# EasyEDA Pro project 3轴6.1--esp32 -(0105).eprj, board PCB
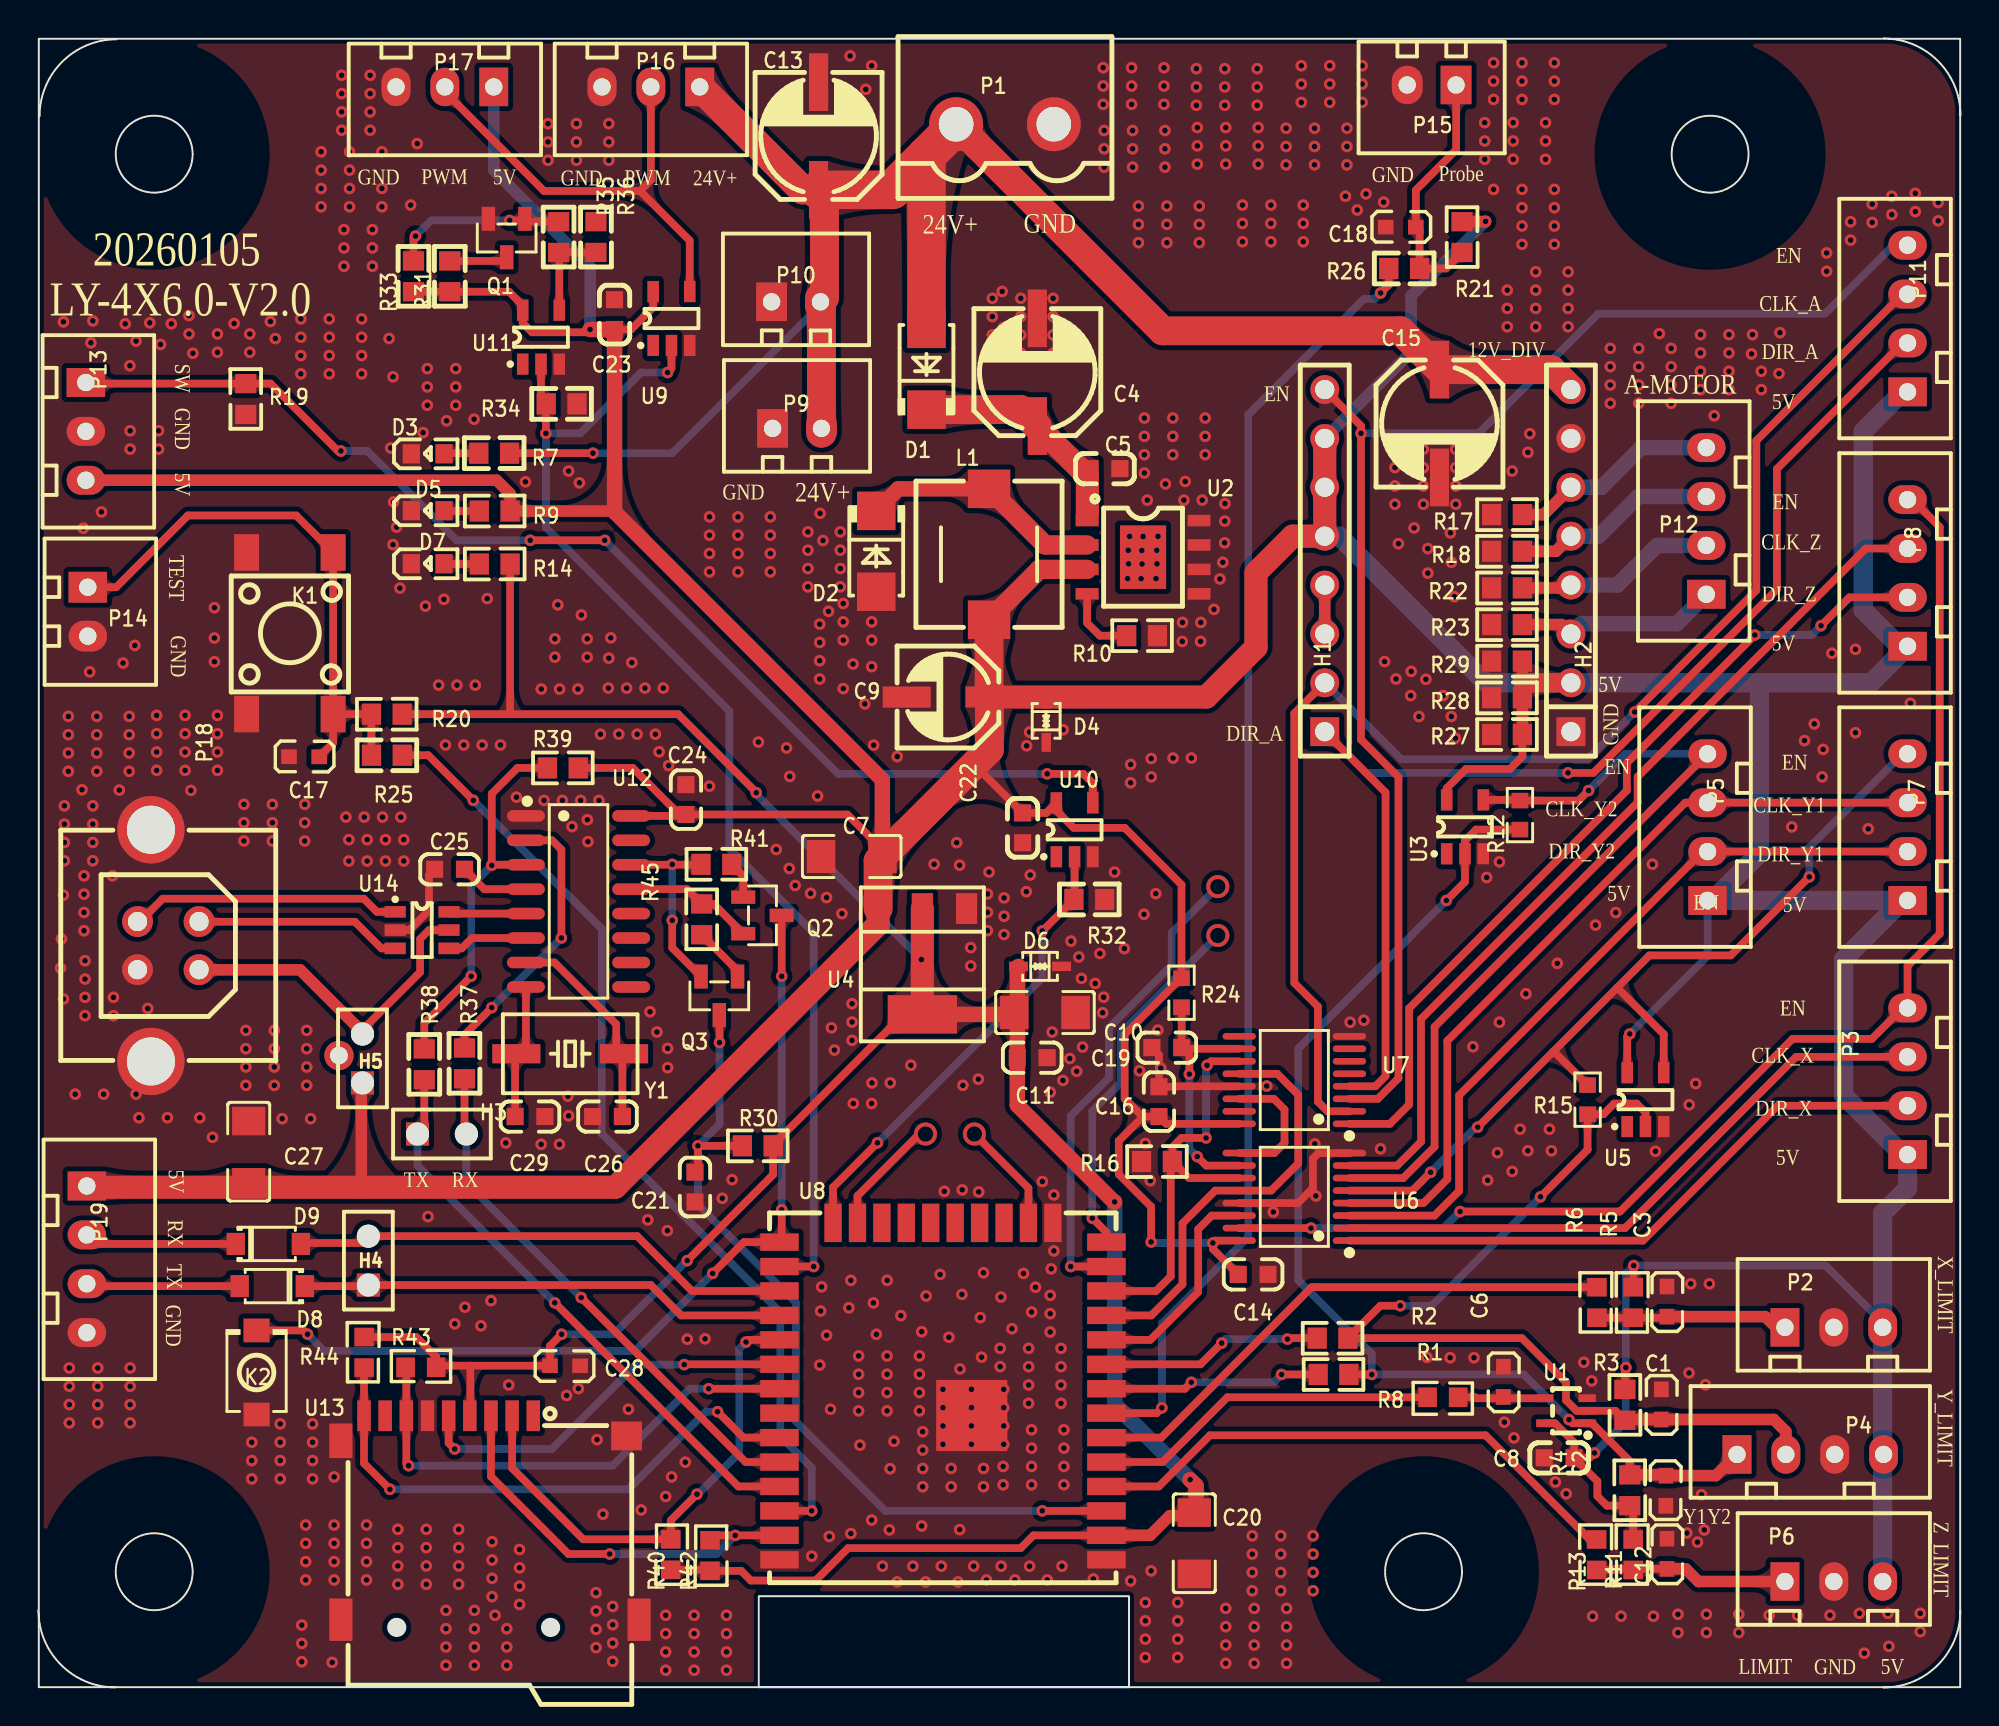
[diagram p1: board, top side]
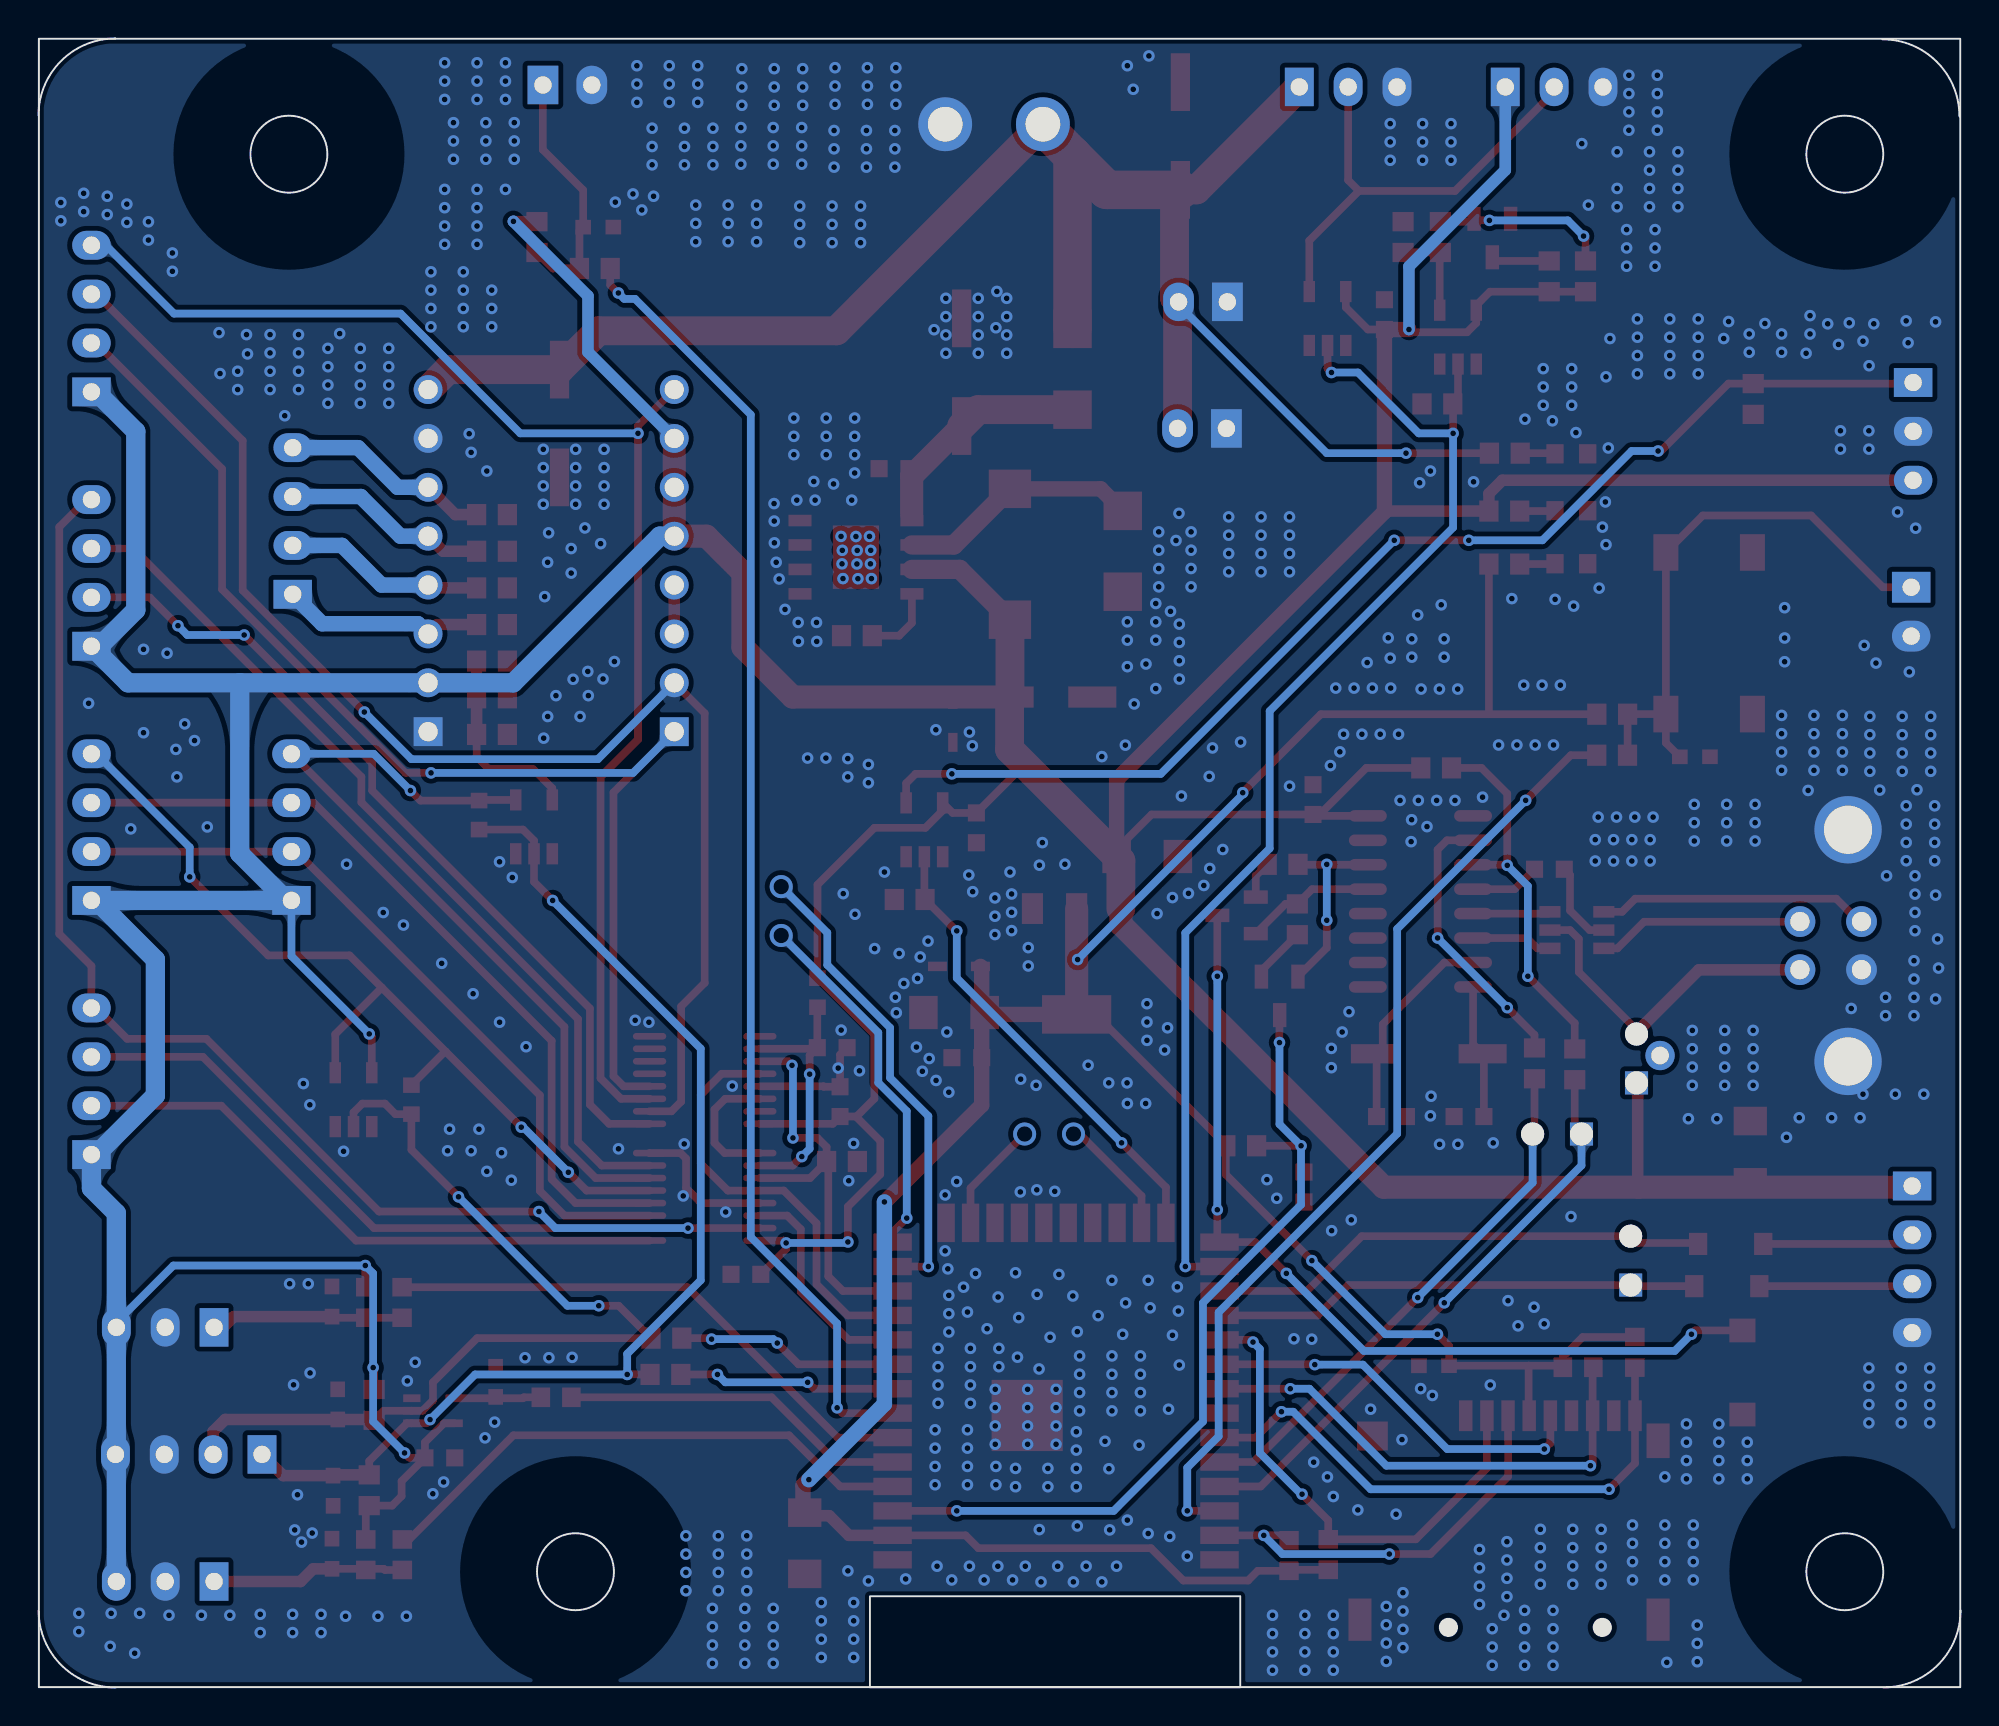
[diagram p2: board, bottom side, seen from below]

Outline 99.94 x 85.7 mm; copper layers: Top Layer, Bottom Layer. Coordinates in mm from the lower left corner of the outline.
Outline path: rectangle 0.02,85.69 99.92,0.02 ; circle c6.02,79.69 r2 ; circle c6.02,6.02 r2 ; rectangle 37.45,4.74 56.7,0.02 ; circle c72.02,6.02 r2 ; circle c86.92,79.69 r2 ; 0.06,81.66 arc(1.23,84.49) 4.06,85.66 ; 4,0.01 arc(1.17,1.18) 0,4.01 ; 95.94,85.7 arc(98.77,84.53) 99.94,81.7 ; 99.93,4 arc(98.76,1.17) 95.93,0
Stack: Top Layer 0.035mm / Dielectric1 1.51mm FR4 er 4.5 / Bottom Layer 0.035mm

## Design rules (mm)
template: 用户自定义配置
spacing Default (default): track to track 0.152, other pairs 0 to 0.152
track width Default (default): min 0.254, default 0.254, max 25.4
differential pair differentialPair (default): width min 0.127, default 0.254, max 2.54; gap min 0.152, default 0.152
via Default (default): diameter min 0.25, default 0.61, max 100.025; hole min 0.2, default 0.305, max 59.995

## Placement (name value [footprint] x y rotation side)
C1  103  [11]  84.68 15.45 90 top
C2  103  [11]  84.32 9.49 270 top
C3  103  [11]  84.97 20.8 90 top
C4  100uF/35V  [电解电容贴片6X6]  51.94 68.36 90 top
C5  104  [0603C]  55.45 63.34 180 top
C6  103  [11]  76.47 16.63 90 top
C7  10uF  [C1206]  42.29 43.19 180 top
C8  104  [0603C]  79.07 11.94 0 top
C9  100uF/10V  [CAP-SMD_BD5.0-L5.3-W5.3-RD]  47.3 51.48 0 top
C10  4.7uF  [C1206]  52.33 35.08 180 top
C11  104  [0603C]  51.67 32.73 180 top
C12  103  [11]  84.97 7.69 90 top
C13  100uF/35V  [电解电容贴片6X6]  40.56 80.63 90 top
C14  104  [0603C]  63.16 21.47 0 top
C15  100uF/35V(47uF/50V)  [电解电容贴片6X6]  72.85 65.69 270 top
C16  104  [0603C]  58.26 30.45 90 top
C17  103  [11]  13.07 48.67 180 top
C18  103  [11]  70.09 76.2 180 top
C19  104  [0603C]  58.67 33.25 0 top
C20  4.7uF  [C1206]  60.1 7.5 270 top
C21  104  [0603C]  34.14 26.01 90 top
C22  104  [0603C]  51.17 44.68 90 top
C23  104  [0603C]  29.95 71.35 270 top
C24  104  [0603C]  33.67 46.15 90 top
C25  104  [0603C]  21.38 42.53 180 top
C26  18pF  [0603C]  29.59 29.67 180 top
C27  10uF  [C1206]  10.93 27.85 90 top
C28  104  [11]  28.12 16.42 0 top
C29  18pF  [0603C]  25.56 29.67 0 top
D1  SS56  [SMA]  46.17 68.51 90 top
D2  SS34  [SMA]  43.56 59.05 270 top
D3  绿光  [0603LED]  20.2 64.1 180 top
D4  PESD5V0L1BA-N  [SOD-323_L1.8-W1.3-LS2.5-BI]  52.39 50.24 90 top
D5  绿光  [0603LED]  20.2 61.14 180 top
D6  PESD3V3L1BA-N  [SOD-323_L1.8-W1.3-LS2.5-BI]  52.08 37.48 180 top
D7  绿光  [0603LED]  20.2 58.39 180 top
D8  1N4148  [SOD-123_L2.8-W1.8-LS3.7-RD]  12.16 20.86 180 top
D9  1N4148  [SOD-123_L2.8-W1.8-LS3.7-RD]  11.95 23.05 0 top
H1  PZ254V-11-08P  [HDR-TH_8P-P2.54-V-M]  66.88 58.57 90 top
H2  PZ254V-11-08P  [HDR-TH_8P-P2.54-V-M]  79.68 58.57 90 top
H3  PZ254V-11-02P  [HDR-TH_2P-P2.54-V-M]  20.98 28.77 0 top
H4  PZ254V-11-02P  [HDR-TH_2P-P2.54-V-M]  17.15 22.19 90 top
H5  PZ254V-11-02P  [HDR-TH_2P-P2.54-V-M]  16.85 32.69 90 top
K1  SW_6X6_H=12.0MM  [KEY-SMD_4P-L6.0-W6.0-P4.50-LS9.0]  13.07 54.79 90 top
K2  TS-1088-AR02016  [SW-SMD_L3.9-W3.0-P4.45]  11.34 16.37 90 top
L1  68uH  [IND-SMD_L7.0-W7.0_SMDRI74-330MT]  49.43 58.9 90 top
NOREF  -  [Pad_e6922]  15.62 32.85 0 top
P1  KF2EDGVC-5.08-2P  [CONN-TH_P5.08_KF2EDGVC-5.08-2P]  50.25 81.24 180 top
P2  3P  [HDR1X3_CON]  93.35 18.72 0 top
P3  4P  [HDR1X4_CON]  97.18 27.7 90 top
P4  4P  [HDR1X4_CON]  88.32 12.11 0 top
P5  4P  [HDR1X4_CON]  86.78 40.91 90 top
P6  3P  [HDR1X3_CON]  93.35 5.51 0 top
P7  4P  [HDR1X4_CON]  97.18 40.91 90 top
P8  4P  [HDR1X4_CON]  97.18 54.11 90 top
P9  2P  [HDR1X2_CON]  39.44 65.44 0 top
P10  2P  [HDR1X2_CON]  39.39 72.01 0 top
P11  4P  [HDR1X4_CON]  97.18 67.34 90 top
P12  4P  [HDR1X4_CON]  86.72 56.82 90 top
P13  3P  [HDR1X3_CON]  2.47 65.28 270 top
P14  2P  [HDR1X2_CON]  2.57 55.91 270 top
P15  2P  [HDR1X2_CON]  72.44 83.28 180 top
P16  3P  [HDR1X3_CON]  31.84 83.18 180 top
P17  3P  [HDR1X3_CON]  21.13 83.18 180 top
P18  USB-B12-BRW  [USB-B-TH_USB-B12-BRW]  6.75 38.56 270 top
P19  4P  [HDR1X4_CON]  2.52 26.06 270 top
Q1  SS8050  [SOT-23-3_L2.9-W1.3-P1.90-LS2.4-BR]  24.34 75.33 90 top
Q2  SS8050  [SOT-23-3_L2.9-W1.3-P1.90-LS2.4-BR]  37.64 40.13 180 top
Q3  SS8050  [SOT-23-3_L2.9-W1.3-P1.90-LS2.4-BR]  35.4 35.95 90 top
R1  10K  [0603R]  67.34 16.27 180 top
R2  10K  [0603R]  67.29 18.16 180 top
R3  10K  [0603R]  82.49 14.69 270 top
R4  10K  [0603R]  82.74 10.25 90 top
R5  47K  [10]  83.04 19.12 90 top
R6  100Ω  [10]  81.15 19.12 90 top
R7  47K  [0603R]  23.69 64.15 0 top
R8  47K  [10]  73.92 15.2 180 top
R9  10K  [0603R]  23.72 61.14 0 top
R10  10K  [0603R]  57.38 54.66 0 top
R11  47K  [10]  83.04 6.01 90 top
R12  0Ω  [R0603]  77.03 45.34 270 top
R13  100Ω  [10]  81.14 6.01 90 top
R14  10K  [0603R]  23.72 58.39 0 top
R15  0Ω  [R0603]  80.55 30.55 270 top
R16  10K  [0603R]  58.16 27.34 180 top
R17  10K  [0603R]  76.36 60.96 180 top
R18  10K  [0603R]  76.36 59.05 180 top
R19  10K  [0603R]  10.78 66.97 90 top
R20  10K  [0603R]  18.11 50.58 180 top
R21  10K  [0603R]  74.02 75.38 270 top
R22  10K  [0603R]  76.36 57.15 180 top
R23  10K  [0603R]  76.36 55.24 180 top
R24  10kΩ  [R0603]  59.43 36.11 90 top
R25  100  [0603R]  18.12 48.45 180 top
R26  100  [0603R]  71.01 73.75 0 top
R27  10K  [0603R]  76.36 49.53 180 top
R28  10K  [0603R]  76.36 51.44 180 top
R29  10K  [0603R]  76.36 53.34 180 top
R30  10K  [0603R]  37.4 28.15 180 top
R31  10K  [0603R]  21.39 73.34 270 top
R32  10K  [0603R]  54.64 40.95 0 top
R33  10K  [0603R]  19.5 73.34 270 top
R34  10K  [0603R]  27.2 66.71 0 top
R35  1K  [0603R]  27.05 75.38 90 top
R36  0Ω  [0603R]  28.99 75.38 270 top
R37  470Ω  [0603R]  22.15 32.44 90 top
R38  470Ω  [0603R]  20.06 32.39 90 top
R39  10K  [0603R]  27.27 47.79 0 top
R40  10K  [10]  32.76 7.8 270 top
R41  10K  [0603R]  35.25 42.78 0 top
R42  10K  [10]  34.8 7.75 270 top
R43  10K  [10]  18.99 16.53 0 top
R44  10K  [10]  17.05 16.53 90 top
R45  10K  [0603R]  34.48 39.92 270 top
U1  SN74AHC1G08  [SC-70-5_L2.1-W1.3-P0.65-LS2.1-BR]  79.42 14.38 0 top
U2  XL1509-5.0E1//SXL1509-5.0E1  [ESOP-8_L4.9-W3.9-P1.27-LS6.0-BL-EP]  57.43 58.74 270 top
U3  74LVC1G17  [SOT-23-5]  74.17 44.73 90 top
U4  1117-3.3  [SOT-223]  45.96 37.78 180 top
U5  74LVC1G17  [SOT-23-5]  83.56 30.55 90 top
U6  74AHCT595T16-13  [TSSOP-16_L5.0-W4.4-P0.65-LS6.4-BL]  65.3 25.5 90 top
U7  74AHCT595T16-13  [TSSOP-16_L5.0-W4.4-P0.65-LS6.4-BL]  65.3 31.57 90 top
U8  ESP32-WROOM-32  [WIFI-SMD_ESP32-WROOM-32UE-A]  47.03 15.39 180 top
U9  74LVC1G17  [SOT-23-5]  32.91 71.15 90 top
U10  74LVC1G17  [SOT-23-5]  53.87 44.58 90 top
U11  74LVC1G17  [SOT-23-5]  26.13 70.18 90 top
U12  CH340G  [SOIC-16_L9.9-W3.9-P1.27-LS6.0-BL]  28.08 40.85 270 top
U13  自弹TF卡座TFAA  [SIM-SMD_C9900015645]  23.48 8.82 0 top
U14  USBLC2-2SC6  [SOT-23-6]  19.95 39.36 0 top
Y1  12M  [晶振贴片49SSMD]  27.65 32.94 0 top

## Footprints (pads in the part's own frame, mm; a bottom-side part is the same pattern mirrored in y, then rotated)
10
  rect 0.965x1.016 smd: 1(0.101,0.117) 2(1.688,0.117)
11
  rect 0.813x0.762 smd: 1(0.043,0.296) 2(-1.524,0.301)
0603C
  rect 0.889x0.889 smd: 1(-0.774,0) 2(0.774,0)
0603LED
  rect 0.9x1 smd: 1(-0.884,-0.017) 2(0.816,-0.017)
0603R
  rect 1x1.1 smd: 1(-0.8,0) 2(0.8,0)
C1206
  rect 1.485x1.728 smd: 1(-1.593,0) 2(1.593,0)
CAP-SMD_BD5.0-L5.3-W5.3-RD
  rect 2.5x1.1 smd: 1(2.15,0) 2(-2.15,0)
CONN-TH_P5.08_KF2EDGVC-5.08-2P
  round 2.8 hole 1.8: 1(-2.54,0) 2(2.54,0)
ESOP-8_L4.9-W3.9-P1.27-LS6.0-BL-EP
  rect 0.6x1.2 smd: 1(-1.905,-2.909) 2(-0.635,-2.909) 3(0.635,-2.909) 4(1.905,-2.909) 5(1.905,2.909) 6(0.635,2.909) 7(-0.635,2.909) 8(-1.905,2.909)
  rect 3.3x2.4 smd: 9(0,0)
HDR1X2_CON
  rect 1.6x2 hole 0.9: 1(-1.27,0)
  oval 1.6x2 hole 0.9: 2(1.27,0)
HDR1X3_CON
  rect 1.5x2 hole 0.9: 1(-2.54,0)
  oval 1.5x2 hole 0.9: 2(0,0) 3(2.54,0)
HDR1X4_CON
  rect 1.5x2 hole 0.9: 1(0,0)
  oval 1.5x2 hole 0.9: 2(2.54,0) 3(5.08,0) 4(7.62,0)
HDR-TH_2P-P2.54-V-M
  rect 1.2x1.2 hole 1.2x0.8: 1(-1.27,0)
  round 1.2 hole 1.2x0.8: 2(1.27,0)
HDR-TH_8P-P2.54-V-M
  rect 1.5x1.5 hole 1: 1(-8.89,0)
  round 1.5 hole 1: 2(-6.35,0) 3(-3.81,0) 4(-1.27,0) 5(1.27,0) 6(3.81,0) 7(6.35,0) 8(8.89,0)
IND-SMD_L7.0-W7.0_SMDRI74-330MT
  rect 2x2.2 smd: 1(-3.4,0) 2(3.4,0)
KEY-SMD_4P-L6.0-W6.0-P4.50-LS9.0
  rect 1.9x1.3 smd: 1(-4.2,2.25) 2(4.2,2.25) 3(-4.2,-2.25) 4(4.2,-2.25)
Pad_e6922
  round 1.524 hole 0.914: 1(0,0)
R0603
  rect 0.806x0.864 smd: 1(-0.753,0) 2(0.753,0)
SC-70-5_L2.1-W1.3-P0.65-LS2.1-BR
  rect 0.9x0.4 smd: 1(1.1,-0.65) 2(1.1,0) 3(1.1,0.65) 4(-1.1,0.65) 5(-1.1,-0.65)
SIM-SMD_C9900015645
  rect 0.7x1.6 smd: 1(2.25,5.3) 2(1.15,5.3) 3(0.05,5.3) 4(-1.05,5.3) 5(-2.15,5.3) 6(-3.25,5.3) 7(-4.35,5.3) 8(-5.45,5.3) 9(-6.55,5.3)
  rect 1.2x1.8 smd: 10(-7.75,4)
  rect 1.6x1.5 smd: 11(7.1,4.25)
  rect 1.2x2.2 smd: 12(-7.75,-5.3) 13(7.75,-5.3)
SMA
  rect 2x2 smd: 1(2.1,0) 2(-2.1,0)
SOD-123_L2.8-W1.8-LS3.7-RD
  rect 0.95x1.15 smd: 1(-1.692,0) 2(1.692,0)
SOD-323_L1.8-W1.3-LS2.5-BI
  rect 0.986x0.49 smd: 1(-1.117,0) 2(1.117,0)
SOIC-16_L9.9-W3.9-P1.27-LS6.0-BL
  oval 0.602x1.971 smd: 1(-4.445,-2.736) 2(-3.175,-2.736) 3(-1.905,-2.736) 4(-0.635,-2.736) 5(0.635,-2.736) 6(1.905,-2.736) 7(3.175,-2.736) 8(4.445,-2.736) 9(4.445,2.736) 10(3.175,2.736) 11(1.905,2.736) 12(0.635,2.736) 13(-0.635,2.736) 14(-1.905,2.736) 15(-3.175,2.736) 16(-4.445,2.736)
SOT-23-3_L2.9-W1.3-P1.90-LS2.4-BR
  rect 1.25x0.7 smd: 1(1,-0.95) 2(1,0.95) 3(-1,0)
SOT-23-5
  rect 1.1x0.6 smd: 1(-1.4,0.95) 2(-1.4,0) 3(-1.4,-0.95) 4(1.4,-0.95) 5(1.4,0.95)
SOT-23-6
  rect 1.1x0.6 smd: 1(-1.4,0.95) 2(-1.4,0) 3(-1.4,-0.95) 4(1.4,-0.95) 5(1.4,0) 6(1.4,0.95)
SOT-223
  rect 1.1x1.6 smd: 1(-2.3,-2.7) 2(0,-2.7) 3(2.3,-2.7)
  rect 3.6x2 smd: 4(0,2.8)
SW-SMD_L3.9-W3.0-P4.45
  rect 1.23x1.36 smd: 1(-2.185,0) 2(2.185,0)
TSSOP-16_L5.0-W4.4-P0.65-LS6.4-BL
  oval 0.343x1.732 smd: 1(-2.275,-2.866) 2(-1.625,-2.866) 3(-0.975,-2.866) 4(-0.325,-2.866) 5(0.325,-2.866) 6(0.975,-2.866) 7(1.625,-2.866) 8(2.275,-2.866) 9(2.275,2.866) 10(1.625,2.866) 11(0.975,2.866) 12(0.325,2.866) 13(-0.325,2.866) 14(-0.975,2.866) 15(-1.625,2.866) 16(-2.275,2.866)
USB-B-TH_USB-B12-BRW
  round 1.6 hole 1: 1(1.25,1.6) 2(-1.25,1.6) 3(-1.25,-1.6) 4(1.25,-1.6)
  round 3.5 hole 2.5: 5(-6.02,-0.9) 6(6.02,-0.9)
WIFI-SMD_ESP32-WROOM-32UE-A
  rect 2x0.9 smd: 1(-8.5,8.755) 2(-8.5,7.485) 3(-8.5,6.215) 4(-8.5,4.945) 5(-8.5,3.675) 6(-8.5,2.405) 7(-8.5,1.135) 8(-8.5,-0.135) 9(-8.5,-1.405) 10(-8.5,-2.675) 11(-8.5,-3.945) 12(-8.5,-5.215) 13(-8.5,-6.485) 14(-8.5,-7.755) 25(8.5,-7.755) 26(8.5,-6.485) 27(8.5,-5.215) 28(8.5,-3.945) 29(8.5,-2.675) 30(8.5,-1.405) 31(8.5,-0.135) 32(8.5,1.135) 33(8.5,2.405) 34(8.5,3.675) 35(8.5,4.945) 36(8.5,6.215) 37(8.5,7.485) 38(8.5,8.755)
  rect 0.9x2 smd: 15(-5.715,-8.755) 16(-4.445,-8.755) 17(-3.175,-8.755) 18(-1.905,-8.755) 19(-0.635,-8.755) 20(0.635,-8.755) 21(1.905,-8.755) 22(3.175,-8.755) 23(4.445,-8.755) 24(5.715,-8.755)
  rect 3.7x3.7 smd: 39(-1.5,1.255)
晶振贴片49SSMD
  rect 2.5x1 smd: 1(-2.8,0) 2(2.8,0)
电解电容贴片6X6
  rect 3x1 smd: 1(-2.8,0) 2(2.8,0)

## Nets
As in the schematic.

Pads without a net: NOREF 1; U2 9; U3 1; U5 1; U7 9; U8 17 18 19 20 21 22 32; U9 1; U10 1; U11 1; U12 9 10 11 12 15; U13 1 8

## Via types
v1: diameter 0.6, hole 0.3, Top Layer to Bottom Layer, 996 vias
v2: diameter 1.2, hole 0.8, Top Layer to Bottom Layer, 4 vias

## Routing (per net, layer and track width the routed paths; a pad name or vN(x,y) marks a point on that pad's centre or on a via; arc(x,y) is an arc through that point)
3V3: length 153.6
  Top Layer w0.4: v1(27.2,18.36) 26.59,17.75 C28.2 22.46,16.72 ; U8.2 51.73,7.91 51.07,7.24 42.09,7.24 40.41,5.56 37.04,5.56 36.54,6.06 R42.2 34.86,6.12 R40.2 ; 24.53,50.58 24.52,50.59 R14.2 ; 24.53,50.58 R20.1 ; 24.53,50.58 33.26,50.58 37.32,46.52 v1(37.32,46.5) ; v1(33.73,22.19) 38.2,26.66 38.2,28.2 44.98,34.98 U4.4 ; U13.4 22.46,14.15 22.46,16.72 ; 22.46,16.72 20.76,16.72 R43.2 20.68,17.18 19.65,18.21 R44.2
  Top Layer w0.6: 60.19,8.93 58.82,8.93 57.8,7.91 U8.2
  Top Layer w0.8: v1(59.88,10.8) 60.19,10.5 60.19,8.93 ; U4.4 50.64,34.98 ; D6.2 50.89,37.41 C11.2 50.89,30.27 55.92,25.24 v1(55.95,25.24)
  Top Layer w1.2: U4.2 U4.4 ; 50.64,34.98 C10.2
  Bottom Layer w0.4: v1(27.2,18.36) 29.9,18.36 v1(33.73,22.19) ; v1(45.91,37.83) 37.32,46.42 v1(37.32,46.5)
  Bottom Layer w0.8: v1(59.88,10.8) 55.95,14.73 v1(55.95,25.24)
5V_VCC: length 451.1
  Top Layer w0.4: v1(57.85,23.16) 57.85,24.99 56.17,26.67 56.17,28.41 57.43,29.67 ; R33.2 R31.2 24.47,72.54 25.18,71.83 U11.5 25.18,70.91 25.66,70.43 28.54,70.43 v1(28.68,70.58) ; C24.1 42.06,45.37 43.88,43.56 ; R27.1 77.16,48.38 76.52,47.74 74.22,47.74 73.22,46.74 73.22,46.13 ; R5.2 82.94,20.83 v1(82.94,21.93) ; 62.43,29.3 58.64,29.3 58.26,29.67 57.43,29.67 ; U9.5 31.96,71.73 30.81,70.58 C23.2 ; 48.77,47.79 48.83,47.79 C22.2 52.4,45.45 U10.5 52.92,45.58 53.82,44.68 56.48,44.68 59.43,41.72 R24.2 59.4,36.86 56.48,33.93 56.48,30.6 57.4,29.67 57.43,29.67 ; U12.16 33.39,45.3 30.9,47.79 R39.2 ; R11.2 82.92,9.27 R4.1 81.55,9.45 81.06,9.95 81.06,10.72 C8.2 ; v1(82.54,16.63) 82.49,16.58 R3.1 ; C8.2 80.65,11.94 v1(80.9,12.19) ; C8.2 79.84,12.74 78.85,13.73 U1.5 ; v1(82.74,33.97) 82.61,33.83 U5.5 ; 62.43,23.23 61.19,23.23 v1(61.07,23.1) 61.07,22.79 C14.1
  Top Layer w0.6: R21.1 75.23,76.18 v1(75.24,76.2) ; R29.1 R28.1 R27.1 ; 29.91,61.14 R9.2 24.52,62.05 23.82,62.74 P13.3 ; 16.74,26 16.79,26.04 16.79,31.31 16.85,31.37
  Top Layer w0.8: 43.88,43.56 43.88,47.18 29.95,61.1 C23.2 v1(28.68,70.58)
  Top Layer w1: H2.2 77.22,52.22 77.16,52.28 ; L1.1 52.04,58.11 U2.3
  Top Layer w1.2: H1.7 H1.6 H1.5 65.21,59.84 63.31,57.94 63.31,54.06 60.72,51.48 C9.1 ; 2.61,26 30,26 43.66,39.66 U4.3
  Top Layer w1.5: U4.3 43.66,42.97 C7.1 49.45,48.75 C9.1 49.43,51.5 L1.1
  Bottom Layer w0.4: v1(61.07,23.1) 57.9,23.1 v1(57.85,23.16) ; 95.89,18.97 92.93,21.93 v1(82.94,21.93) 82.54,21.52 v1(82.54,16.63) 82.54,13.82 v1(80.9,12.19) ; P5.1 86.78,38.01 v1(82.74,33.97)
  Bottom Layer w0.6: P17.1 23.67,78.86 28.68,73.85 v1(28.68,70.58) ; H1.7 71.37,69.4 71.37,72.32 v1(75.24,76.2)
  Bottom Layer w1: P6.3 P2.3 95.89,24.65 97.18,25.95 P3.1 96.93,27.7 93.86,30.77 93.86,37.83 96.93,40.91 ; H1.5 67.63,59.84 75.25,52.22 H2.2 89.47,52.22 ; 89.47,52.22 95.28,52.22 P8.1 96.76,54.11 94.88,56 94.88,65.28 96.93,67.34 P11.1 ; 89.47,52.22 89.47,43.34 87.03,40.91 ; 96.93,40.91 P7.1 ; 96.93,40.91 87.03,40.91 ; 87.03,40.91 P5.1
24V: length 95.7
  Top Layer w0.4: R7.2 v1(28.83,64.15)
  Top Layer w1.5: H2.8 78.65,68.49 C15.1 70.83,70.51 58.45,70.51 P1.2 ; C13.1 39.73,77.83 P16.1 ; P9.2 40.71,71.96 P10.2 40.87,72.22 40.87,77.83
  Top Layer w2: P1.2 47.71,81.15 46.17,79.61 ; D1.1 46.17,79.61 ; 46.17,79.61 44.39,77.83 C13.1
  Bottom Layer w0.4: P10.2 40.66,71.86 32.95,64.15 v1(28.83,64.15)
GND: length 18.5
  Top Layer w0.4: C19.1 58.26,32.89 C16.2 59.1,31.22 59.13,31.25 62.43,31.25 ; 62.43,25.18 65.48,25.18 66.27,25.96 66.27,27.49 66.55,27.77 68.16,27.77 U6.8 ; U14.2 19.28,39.36 20.3,40.38 20.3,42.23 C25.2
  vias: v1(1.19,38.9) v1(1.14,37.39) v1(1.3,70.97) v1(1.3,41.18) v1(1.3,35.78) v1(1.35,45.82) v1(1.35,44.87) v1(1.35,43.92) v1(1.35,42.97) v1(1.55,50.47) v1(1.55,49.52) v1(1.55,48.57) v1(1.55,47.61) v1(1.6,16.61) v1(1.6,15.65) v1(1.6,14.7) v1(1.6,13.75) v1(1.91,30.84) v1(2.26,46.66) v1(2.33,60.25) v1(2.37,42.19) v1(2.37,41.23) v1(2.37,40.28) v1(2.37,39.33) v1(2.42,37.77) v1(2.42,36.82) v1(2.42,35.87) v1(2.42,34.92) v1(2.66,52.78) v1(2.73,69.89) v1(2.83,71.02) v1(2.83,45.82) v1(2.83,44.87) v1(2.83,43.92) v1(2.83,42.97) v1(3.03,50.47) v1(3.03,49.52) v1(3.03,48.57) v1(3.03,47.61) v1(3.08,16.61) v1(3.08,15.65) v1(3.08,14.7) v1(3.08,13.75) v1(3.28,61.09) v1(3.39,30.84) v1(3.85,42.19) v1(3.9,35.87) v1(3.9,34.92) v1(4.2,46.64) v1(4.4,53.24) v1(4.51,70.87) v1(4.75,68.69) v1(4.77,65.31) v1(4.77,64.36) v1(4.72,50.47) v1(4.72,49.52) v1(4.72,48.57) v1(4.72,47.61) v1(4.77,16.61) v1(4.77,15.65) v1(4.77,14.7) v1(4.77,13.75) v1(5.01,54.16) v1(5.07,69.97) v1(5.07,30.84) v1(5.22,29.61) v1(5.68,35.29) v1(5.79,70.92) v1(6.14,50.52) v1(6.14,49.57) v1(6.14,48.62) v1(6.14,47.67) v1(6.25,65.31) v1(6.25,64.36) v1(6.35,69.8) v1(6.7,29.61) v1(6.91,70.87) v1(7.62,50.52) v1(7.62,49.57) v1(7.62,48.62) v1(7.62,47.67) v1(7.83,71.3) v1(7.83,70.34) v1(7.93,46.62) v1(8.03,69.34) v1(8.39,29.61) v1(9.05,28.59) v1(9.15,56.12) v1(9.15,54.54) v1(9.15,53.31) v1(9.31,70.34) v1(9.31,69.39) v1(9.31,50.52) v1(9.31,49.57) v1(9.31,48.62) v1(9.31,47.67) v1(10.17,70.89) v1(10.68,45.9) v1(10.68,44.95) v1(10.68,43.99) v1(10.78,34.15) v1(10.78,33.2) v1(10.78,32.25) v1(10.78,31.3) v1(10.99,70.34) v1(10.99,69.39) v1(11.09,12.75) v1(11.09,11.8) v1(11.09,10.84) v1(12.06,70.99) v1(12.16,45.9) v1(12.16,44.95) v1(12.16,43.99) v1(12.31,70.11) v1(12.26,34.15) v1(12.26,33.2) v1(12.26,32.25) v1(12.26,31.3) v1(12.57,13.7) v1(12.57,12.75) v1(12.57,11.8) v1(12.57,10.84) v1(12.67,29.56) v1(13.64,71.13) v1(13.64,70.17) v1(13.64,69.22) v1(13.64,68.27) v1(13.69,3.24) v1(13.69,2.29) v1(13.69,1.34) v1(13.84,45.9) v1(13.84,44.95) v1(13.84,43.99) v1(13.89,8.45) v1(13.89,7.49) v1(13.89,6.54) v1(13.89,5.59) v1(13.95,34.15) v1(13.95,33.2) v1(13.95,32.25) v1(13.95,31.3) v1(14.15,29.56) v1(14.25,13.7) v1(14.25,12.75) v1(14.25,11.8) v1(14.25,10.84) v1(14.69,79.81) v1(14.69,78.86) v1(14.69,77.91) v1(14.69,76.95) v1(15.12,71.13) v1(15.12,70.17) v1(15.12,69.22) v1(15.12,68.27) v1(15.27,1.31) v1(15.37,10.95) v1(15.37,8.45) v1(15.37,7.49) v1(15.37,6.54) v1(15.37,5.59) v1(15.77,83.79) v1(15.77,82.84) v1(15.77,81.89) v1(15.77,80.93) v1(15.88,75.77) v1(15.88,74.82) v1(15.88,73.86) v1(15.98,45.24) v1(16.17,79.81) v1(16.17,78.86) v1(16.17,77.91) v1(16.17,76.95) v1(16.14,44.06) v1(16.14,42.95) v1(16.8,71.13) v1(16.8,70.17) v1(16.8,69.22) v1(16.8,68.27) v1(16.94,45.24) v1(17.09,44.06) v1(17.09,42.95) v1(17.06,8.45) v1(17.06,7.49) v1(17.06,6.54) v1(17.06,5.59) v1(17.25,83.79) v1(17.25,82.84) v1(17.25,81.89) v1(17.25,80.93) v1(17.36,75.77) v1(17.36,74.82) v1(17.36,73.86) v1(17.86,79.81) v1(17.86,77.91) v1(17.86,76.95) v1(17.89,45.24) v1(18.04,44.06) v1(18.04,42.95) v1(18.23,70.11) v1(18.31,64.42) v1(18.43,68.12) v1(18.47,61.61) v1(18.43,59.4) v1(18.62,60.31) v1(18.69,8.22) v1(18.69,7.27) v1(18.69,6.32) v1(18.69,5.37) v1(18.79,57.14) v1(18.84,45.24) v1(18.99,44.06) v1(18.99,42.95) v1(19.35,77.04) v1(19.69,80.24) v1(20,65.22) v1(20.12,56.2) v1(20.16,8.22) v1(20.16,7.27) v1(20.16,6.32) v1(20.16,5.37) v1(20.22,68.54) v1(20.22,67.59) v1(20.22,66.64) v1(20.25,24.47) v1(20.81,52.09) v1(21.08,56.55) v1(21.16,48.98) v1(21.19,4.01) v1(21.19,3.06) v1(21.19,2.11) v1(21.19,1.15) v1(21.22,65.83) v1(21.7,68.54) v1(21.7,67.59) v1(21.7,66.64) v1(21.65,18.9) v1(21.76,52.09) v1(21.85,8.22) v1(21.85,7.27) v1(21.85,6.32) v1(21.85,5.37) v1(22.12,48.98) v1(22.17,19.77) v1(22.65,65.92) v1(22.71,52.09) v1(22.67,4.01) v1(22.67,3.06) v1(22.67,2.11) v1(22.67,1.15) v1(23.01,18.8) v1(23.07,48.98) v1(23.33,56.59) v1(23.53,20.1) v1(23.58,7.58) v1(23.58,6.63) v1(23.58,5.68) v1(23.58,4.72) v1(23.74,3.75) v1(24.02,48.98) v1(24.3,28.3) v1(24.35,3.06) v1(24.35,2.11) v1(24.35,1.15) v1(24.45,15.72) v1(24.85,46.27) v1(25.01,7.17) v1(25.01,6.22) v1(25.01,5.27) v1(25.01,4.32) v1(25.32,62.66) v1(26.14,51.89) v1(26.14,28.23) v1(26.29,46.1) v1(26.49,81.28) v1(26.49,80.32) v1(26.49,79.37) v1(26.85,54.5) v1(26.85,53.55) v1(27,56.27) v1(27.1,51.89) v1(27.09,28.23) v1(27.24,46.1) v1(27.46,15.18) v1(27.56,63.22) v1(27.53,30.73) v1(27.56,29.71) v1(27.74,44.74) v1(27.97,81.28) v1(27.97,80.32) v1(27.97,79.37) v1(28.05,51.89) v1(28.07,15.54) v1(28.12,62.61) v1(28.19,46.1) v1(28.23,55.74) v1(28.53,54.5) v1(28.53,53.55) v1(28.54,45.1) v1(28.57,43.96) v1(28.99,4.93) v1(28.99,3.98) v1(28.99,3.02) v1(28.99,2.07) v1(29.04,12.88) v1(29.14,46.1) v1(29.22,49.54) v1(29.35,9.01) v1(29.65,81.28) v1(29.65,80.32) v1(29.65,79.37) v1(29.65,53.5) v1(29.63,51.94) v1(29.76,54.55) v1(29.86,4.21) v1(29.86,3.26) v1(29.86,2.31) v1(29.86,1.36) v1(30.17,49.54) v1(30.58,51.94) v1(30.67,14.46) v1(30.85,53.27) v1(31.13,49.54) v1(31.34,9.23) v1(31.53,51.94) v1(31.68,24.3) v1(31.8,35.12) v1(32.08,49.54) v1(32.15,34.07) v1(32.27,48.63) v1(32.49,51.94) v1(32.61,9.93) v1(32.61,3.75) v1(32.61,2.8) v1(32.61,1.85) v1(32.61,0.9) v1(32.71,33.22) v1(32.71,32.21) v1(32.7,23.74) v1(32.76,47.91) v1(32.92,10.95) v1(33.63,11.71) v1(33.73,18.1) v1(34.09,3.75) v1(34.09,2.8) v1(34.09,1.85) v1(34.09,0.9) v1(34.66,18.12) v1(34.89,60.84) v1(34.89,59.89) v1(34.89,58.93) v1(34.89,57.98) v1(34.89,46.84) v1(35.55,25.42) v1(35.77,3.75) v1(35.77,2.8) v1(35.77,1.85) v1(35.77,0.9) v1(36.07,26.39) v1(36.37,60.84) v1(36.37,59.89) v1(36.37,58.93) v1(36.37,57.98) v1(37.43,49.14) v1(38.05,60.84) v1(38.05,59.89) v1(38.05,58.93) v1(38.05,57.98) v1(38.36,43.55) v1(38.89,48.83) v1(39.07,47.35) v1(39.04,42.57) v1(39.34,41.68) v1(40.01,60.06) v1(40.01,59.11) v1(40.01,58.16) v1(40.01,57.2) v1(40.14,41.27) v1(40.21,6.83) v1(40.51,46.33) v1(40.64,61.02) v1(40.62,55.27) v1(40.62,54.31) v1(40.62,53.36) v1(40.62,52.41) v1(40.67,19.56) v1(40.62,16.76) v1(40.79,59.61) v1(40.72,20.82) v1(40.98,41.05) v1(40.98,18.31) v1(41.08,55.93) v1(41.18,14.46) v1(41.12,7.85) v1(41.23,34.29) v1(41.38,33.13) v1(41.69,60.06) v1(41.69,59.11) v1(41.69,58.16) v1(41.69,57.2) v1(41.78,40.22) v1(41.84,56.34) v1(41.84,55.38) v1(41.84,54.43) v1(41.84,51.92) v1(42.2,84.79) v1(42.14,19.73) v1(42.3,35.54) v1(42.3,34.58) v1(42.3,33.63) v1(42.24,21.16) v1(42.24,8) v1(42.35,53.19) v1(42.37,30.35) v1(42.64,17.23) v1(42.64,16.28) v1(42.64,15.33) v1(42.64,14.38) v1(42.71,12.59) v1(42.97,51.12) v1(43.02,83.06) v1(43.32,84.28) v1(43.32,55.38) v1(43.32,54.43) v1(43.32,53.06) v1(43.34,31.42) v1(43.32,30.35) v1(43.41,19.99) v1(43.32,8.7) v1(43.42,48.97) v1(43.57,18.36) v1(43.88,6.3) v1(44.13,21.16) v1(44.12,17.23) v1(44.12,16.28) v1(44.12,15.33) v1(44.12,14.38) v1(44.29,31.42) v1(44.28,11.37) v1(44.24,8.19) v1(44.48,12.8) v1(44.65,48.38) v1(44.65,5.49) v1(44.84,19.33) v1(45.36,32.34) v1(45.46,6.3) v1(45.8,17.23) v1(45.8,16.28) v1(45.8,15.33) v1(45.8,14.38) v1(45.92,18.49) v1(45.97,13.29) v1(45.97,12.34) v1(45.97,11.39) v1(45.97,10.44) v1(45.92,8.4) v1(46.16,20.35) v1(46.13,5.49) v1(46.57,42.79) v1(46.88,21.47) v1(46.94,6.3) v1(47.1,25.79) v1(47.03,15.5) v1(47.03,14.55) v1(47.03,13.59) v1(47.03,12.64) v1(47.34,18.2) v1(47.45,11.39) v1(47.45,10.44) v1(47.74,43.91) v1(47.81,5.49) v1(47.89,42.74) v1(47.91,16.56) v1(47.9,8.21) v1(48.01,20.43) v1(48.07,31.3) v1(48.03,25.86) v1(48.47,38.45) v1(48.47,37.5) v1(48.51,15.5) v1(48.51,14.55) v1(48.51,13.59) v1(48.51,12.64) v1(48.63,6.3) v1(48.87,31.62) v1(48.89,25.76) v1(48.97,19.22) v1(49.03,17.17) v1(49.14,21.55) v1(49.14,11.39) v1(49.14,10.44) v1(49.29,5.59) v1(49.34,41.24) v1(49.34,40.29) v1(49.34,39.34) v1(49.42,42.38) v1(49.6,72.2) v1(49.6,71.25) v1(49.6,70.29) v1(49.6,69.34) v1(50,17.63) v1(50,16.67) v1(50.11,72.55) v1(50.04,20.29) v1(50.05,6.3) v1(50.16,70.67) v1(50.21,41.04) v1(50.21,40.08) v1(50.21,39.13) v1(50.19,15.5) v1(50.19,14.55) v1(50.19,13.59) v1(50.19,12.64) v1(50.16,11.49) v1(50.16,10.54) v1(50.62,18.65) v1(50.77,5.59) v1(51.07,72.2) v1(51.07,71.25) v1(51.07,70.29) v1(51.07,69.34) v1(51.22,21.52) v1(51.38,48.94) v1(51.36,41.36) v1(51.48,17.63) v1(51.48,16.67) v1(51.48,15.72) v1(51.48,14.77) v1(51.53,49.66) v1(51.57,42.23) v1(51.53,6.3) v1(51.64,19.51) v1(51.64,13.39) v1(51.64,12.44) v1(51.64,11.49) v1(51.64,10.54) v1(51.84,20.81) v1(52.2,26.3) v1(52.45,5.59) v1(52.6,30.94) v1(52.6,20.38) v1(52.6,19.43) v1(52.6,18.48) v1(52.71,34.07) v1(52.66,21.76) v1(52.76,72.2) v1(52.76,71.25) v1(52.76,70.29) v1(52.76,69.34) v1(52.8,25.6) v1(52.8,22.69) v1(53.17,17.63) v1(53.17,16.67) v1(53.17,15.72) v1(53.17,14.77) v1(53.28,49.77) v1(53.27,31.55) v1(53.22,6.3) v1(53.37,70.57) v1(53.32,13.39) v1(53.32,12.44) v1(53.32,11.49) v1(53.32,10.54) v1(53.69,38.79) v1(53.62,32.69) v1(53.98,32.03) v1(54.09,37.97) v1(54.23,36.85) v1(54.29,33.28) v1(54.85,5.64) v1(54.94,36.59) v1(55.19,38.15) v1(55.36,84.18) v1(55.36,83.23) v1(55.36,82.28) v1(55.41,80.92) v1(55.41,79.97) v1(55.41,79.01) v1(55.39,35.88) v1(55.33,35.07) v1(55.95,42.38) v1(56.46,38.4) v1(56.79,47.97) v1(56.79,47.02) v1(56.79,5.54) v1(56.84,84.18) v1(56.84,83.23) v1(56.84,82.28) v1(56.89,80.92) v1(56.89,79.97) v1(56.89,79.01) v1(57.19,76.99) v1(57.19,76.04) v1(57.19,75.09) v1(57.25,32.05) v1(57.5,65.97) v1(57.5,65.02) v1(57.5,64.07) v1(57.5,63.12) v1(57.48,40.19) v1(57.55,28.28) v1(57.55,4.42) v1(57.55,3.47) v1(57.55,2.51) v1(57.55,1.56) v1(57.65,61.71) v1(57.81,26.34) v1(57.86,48.28) v1(57.86,47.33) v1(57.85,6.06) v1(58.09,41.26) v1(58.2,34.17) v1(58.36,32.19) v1(58.52,84.18) v1(58.52,83.23) v1(58.52,82.28) v1(58.57,80.92) v1(58.57,79.97) v1(58.57,79.01) v1(58.6,62.55) v1(58.67,76.99) v1(58.67,76.04) v1(58.67,75.09) v1(58.98,65.97) v1(58.98,65.02) v1(58.98,64.07) v1(58.99,48.3) v1(59.23,4.42) v1(59.23,3.47) v1(59.23,2.51) v1(59.23,1.56) v1(59.48,55.35) v1(59.47,54.36) v1(59.56,61.71) v1(59.62,62.68) v1(59.95,48.3) v1(60.2,84.13) v1(60.2,83.18) v1(60.2,82.23) v1(60.25,81.07) v1(60.25,80.12) v1(60.25,79.17) v1(60.36,76.99) v1(60.36,76.04) v1(60.36,75.09) v1(60.51,61.71) v1(60.44,55.35) v1(60.42,54.36) v1(60.66,65.97) v1(60.66,65.02) v1(60.66,64.07) v1(61.12,56.03) v1(61.43,57.61) v1(61.58,58.48) v1(61.68,84.13) v1(61.68,83.18) v1(61.68,82.23) v1(61.69,61.53) v1(61.68,60.62) v1(61.67,59.49) v1(61.73,81.07) v1(61.73,80.12) v1(61.73,79.17) v1(61.73,4.11) v1(61.73,3.16) v1(61.73,2.21) v1(61.73,1.26) v1(62.6,77.04) v1(62.6,76.09) v1(62.6,75.14) v1(63.11,7.89) v1(63.11,6.93) v1(63.11,5.98) v1(63.11,5.03) v1(63.21,4.11) v1(63.21,3.16) v1(63.21,2.21) v1(63.21,1.26) v1(63.37,84.13) v1(63.37,83.18) v1(63.37,82.23) v1(63.42,81.07) v1(63.42,80.12) v1(63.42,79.17) v1(63.86,31.26) v1(64.08,77.04) v1(64.08,76.09) v1(64.08,75.14) v1(64.21,24.71) v1(64.59,7.89) v1(64.59,6.93) v1(64.59,5.98) v1(64.59,5.03) v1(64.87,81.04) v1(64.87,80.09) v1(64.87,79.13) v1(64.9,4.11) v1(64.9,3.16) v1(64.9,2.21) v1(64.9,1.26) v1(65.66,84.28) v1(65.66,83.33) v1(65.66,82.38) v1(65.76,77.04) v1(65.76,76.09) v1(65.76,75.14) v1(66.27,7.89) v1(66.27,6.93) v1(66.27,5.98) v1(66.27,5.03) v1(66.35,81.04) v1(66.35,80.09) v1(66.35,79.13) v1(66.36,28.25) v1(66.41,25.55) v1(67.14,84.28) v1(67.14,83.33) v1(67.14,82.38) v1(67.96,77.5) v1(68.03,81.04) v1(68.03,80.09) v1(68.03,79.13) v1(68.2,34.57) v1(68.57,76.79) v1(68.82,84.28) v1(68.82,83.33) v1(68.82,82.38) v1(68.91,34.68) v1(69.03,77.62) v1(69.78,28) v1(69.95,77.2) v1(69.99,53.32) v1(70.53,64.35) v1(70.53,63.4) v1(70.53,62.45) v1(70.53,61.49) v1(70.58,52.42) v1(70.71,59.45) v1(71.37,52.81) v1(71.35,51.55) v1(71.53,60.26) v1(71.78,50.46) v1(72.01,64.35) v1(72.01,63.4) v1(72.01,62.45) v1(72.01,61.49) v1(72.14,52.4) v1(72.19,17.16) v1(72.24,59.19) v1(72.24,57.92) v1(73.03,51.55) v1(73.41,60.01) v1(73.4,17.14) v1(73.46,58.48) v1(73.46,50.46) v1(73.69,64.35) v1(73.69,63.4) v1(73.69,62.45) v1(73.69,61.49) v1(73.62,56.69) v1(73.67,49.34) v1(74.59,33.3) v1(74.64,17.14) v1(75.2,81.33) v1(75.2,80.37) v1(75.2,79.42) v1(75.3,42.1) v1(75.35,26.36) v1(75.66,84.44) v1(75.66,83.49) v1(75.66,82.53) v1(75.66,77.86) v1(75.86,27.79) v1(75.96,42.91) v1(75.96,34.58) v1(76.22,13.79) v1(76.37,72.62) v1(76.37,71.67) v1(76.37,70.72) v1(76.68,81.33) v1(76.68,80.37) v1(76.68,79.42) v1(76.63,63.22) v1(76.63,26.82) v1(76.72,12.97) v1(77.03,29.02) v1(77.14,84.44) v1(77.14,83.49) v1(77.14,82.53) v1(77.14,77.86) v1(77.14,76.91) v1(77.14,75.95) v1(77.14,75) v1(77.34,36.06) v1(77.44,64.19) v1(77.44,27.89) v1(77.54,65.16) v1(77.85,73.57) v1(77.85,72.62) v1(77.85,71.67) v1(77.85,70.72) v1(78.36,81.33) v1(78.36,80.37) v1(78.36,79.42) v1(78.56,29.02) v1(78.67,27.89) v1(78.82,84.44) v1(78.82,83.49) v1(78.82,82.53) v1(78.82,77.86) v1(78.82,76.91) v1(78.82,75.95) v1(78.82,75) v1(78.87,10.68) v1(78.97,37.64) v1(79.43,10.07) v1(79.53,73.57) v1(79.53,72.62) v1(79.53,71.67) v1(79.53,70.72) v1(80.35,16.9) v1(80.76,15.93) v1(80.81,3.7) v1(80.96,39.62) v1(81.73,69.6) v1(81.73,68.64) v1(81.73,67.69) v1(81.73,66.74) v1(82.01,40.28) v1(82.29,3.7) v1(83.2,69.6) v1(83.2,68.64) v1(83.2,67.69) v1(83.2,66.74) v1(83.92,42.79) v1(83.97,3.7) v1(84.07,27.87) v1(84.28,70.36) v1(84.89,69.6) v1(84.89,68.64) v1(84.89,67.69) v1(84.89,66.74) v1(85.24,3.81) v1(85.24,2.85) v1(85.71,8.03) v1(85.83,30.28) v1(85.91,20.98) v1(85.82,16.35) v1(86.17,31.39) v1(86.26,7.56) v1(86.42,70.31) v1(86.42,69.36) v1(86.42,68.41) v1(86.42,67.45) v1(86.47,10.02) v1(86.61,8.19) v1(86.67,15.73) v1(86.72,3.81) v1(86.72,2.85) v1(86.88,20.98) v1(87.13,66.09) v1(87.9,70.31) v1(87.9,69.36) v1(87.9,68.41) v1(87.9,67.45) v1(88.41,3.81) v1(88.41,2.85) v1(89.07,69.31) v1(89.12,70.31) v1(89.58,68.41) v1(89.58,67.45) v1(89.99,3.75) v1(90.5,68.29) v1(90.55,70.41) v1(91.16,44.72) v1(91.47,3.75) v1(91.82,49.21) v1(92.33,50.08) v1(92.79,48.75) v1(92.74,47.33) v1(92.98,74.55) v1(92.98,73.6) v1(93.15,3.75) v1(93.25,53.75) v1(94.22,76.18) v1(94.22,75.22) v1(94.48,53.96) v1(94.48,49.62) v1(94.68,3.86) v1(94.93,1.78) v1(95.14,44.62) v1(95.34,77.09) v1(95.34,76.14) v1(96.16,3.86) v1(96.21,2.14) v1(96.36,77.5) v1(96.36,76.55) v1(97.33,51.15) v1(97.59,77.65) v1(97.59,76.7) v1(97.84,3.86) v1(97.84,2.9) v1(98.78,77.18) v1(98.78,76.23)
VIN_24V: length 11.8
  Top Layer w1.2: C4.1 54.54,62.96 54.54,61
  Top Layer w1.5: D1.2 51.08,66.41 C4.1
(no net):
  vias: v1(56.66,59.1) v1(56.68,58.4) v1(56.63,57.63) v1(56.73,59.82) v1(57.37,59.09) v1(57.38,58.39) v1(57.33,57.63) v1(57.43,59.82) v1(58.11,57.63) v1(58.21,59.82) v1(58.14,59.1) v1(58.16,58.4)
A_DIR_O: length 65.4
  Top Layer w0.4: U7.4 69.51,31.25 70.04,31.77 70.04,46.51 H1.1 ; v1(79.53,47.53) 80.85,47.53 90.39,57.07 90.39,63.33 96.93,69.88 P11.2
  Bottom Layer w0.4: v1(79.53,47.53) 69.02,47.53 H1.1
A_STEP_O: length 71.3
  Top Layer w0.4: v1(83,50.7) 89.32,57.02 89.32,64.8 96.93,72.42 P11.3 ; U7.2 67.02,29.95 66.52,30.45 66.52,35.4 65.3,36.62 65.3,50.63 H1.2
  Bottom Layer w0.4: v1(83,50.7) 80.55,48.25 70.85,48.25 H1.2
B_1A: length 10.5
  Top Layer w0.6: H2.4 79.53,57.15 R22.1
  Bottom Layer w0.8: P12.2 84.16,59.36 82.1,57.3 H2.4
B_1B: length 10.6
  Top Layer w0.6: R23.1 79.2,55.24 H2.3
  Bottom Layer w0.8: P12.1 85.19,55.29 80.21,55.29 H2.3
B_2A: length 10.7
  Top Layer w0.6: H2.5 78.9,59.05 R18.1
  Bottom Layer w0.8: H2.5 81.12,59.84 83.18,61.9 P12.3
B_2B: length 11
  Top Layer w0.6: R17.1 78.26,60.96 H2.6
  Bottom Layer w0.8: P12.4 83.32,64.44 81.26,62.38 H2.6
CHANGE: length 24.2
  Top Layer w0.4: U10.2 53.87,40.99 R32.1 52.21,39.32 v1(52.19,39.32) ; U8.24 41.31,26 v1(43.62,28.31)
  Bottom Layer w0.4: v1(43.62,28.31) 52.19,36.87 v1(52.19,39.32)
CHANGE_O: length 62
  Top Layer w0.4: P13.1 2.52,67.76 R19.2 12.07,67.76 15.57,64.26 v1(15.73,64.26) ; v1(29.44,59.62) v1(25.57,59.62) ; v1(52.45,47.48) 54.33,47.48 54.82,46.99 U10.4
  Bottom Layer w0.4: v1(29.44,59.62) 41.58,47.48 v1(52.45,47.48) ; v1(25.57,59.62) 21.74,59.62 17.1,64.26 v1(15.73,64.26)
ESP_BOOT: length 47
  Top Layer w0.4: Q2.3 v1(38.64,36.97) ; v1(38.64,24.83) 38.64,23.26 U8.25 36.68,23.15 v1(35.05,21.52) ; v1(13.99,18.36) 13.8,18.56 K2.2
  Bottom Layer w0.4: v1(38.64,36.97) v1(38.64,24.83) ; v1(35.05,21.52) 31.03,17.49 14.86,17.49 v1(13.99,18.36)
ESP_RST: length 45.5
  Top Layer w0.4: R30.2 v1(34.29,28.15) 34.29,26.94 C21.2 ; v1(52.19,9.18) 55.53,9.18 U8.3 ; v1(35.41,33.52) 35.41,34.94 Q3.3
  Bottom Layer w0.4: v1(35.41,33.52) 35.41,29.28 v1(34.29,28.15) 34.29,25.09 39.39,19.99 39.39,13.82 44.03,9.18 v1(52.19,9.18)
I2S_BCK: length 21.7
  Top Layer w0.4: v1(60.76,32.34) 60.97,32.55 62.43,32.55 ; R16.1 59.82,26.48 62.43,26.48 ; R16.1 58.87,27.25 58.87,21.37 58.11,20.61 U8.12 ; R16.1 58.96,28.09 59.43,28.56 v1(60.71,28.56)
  Bottom Layer w0.4: v1(60.76,32.34) 60.71,32.28 v1(60.71,28.56)
I2S_DATA: length 11.5
  Top Layer w0.4: U8.10 57.81,18.07 60.3,20.55 60.3,23.82 61.01,24.53 62.43,24.53
I2S_MR#: length 13.4
  Top Layer w0.4: 62.43,27.13 60.71,27.13 v1(60.25,27.59) ; 62.43,33.2 59.5,33.2 ; 59.5,33.2 59.84,32.86 v1(59.84,31.88) ; 59.5,33.2 C19.2 59.44,35.35 R24.1
  Bottom Layer w0.4: v1(59.84,31.88) 59.84,28 v1(60.25,27.59)
I2S_WS: length 22.2
  Top Layer w0.4: U8.11 57.86,19.34 59.48,20.96 59.48,24.12 61.19,25.83 64.09,25.83 65.5,27.24 65.5,30.81 64.41,31.9 62.43,31.9
IO12: length 18.9
  Top Layer w0.4: U8.14 55.53,23.66 v1(54.79,24.39)
  Bottom Layer w0.4: v2(61.32,39.08) 56.27,34.03 56.27,31.43 54.79,29.95 v1(54.79,24.39)
IO13: length 5.8
  Top Layer w0.4: v2(48.66,28.77) 51.47,25.95 U8.16
IO14: length 24.8
  Top Layer w0.4: U8.13 v1(53.67,21.88)
  Bottom Layer w0.4: v2(61.32,41.62) 58.92,39.23 58.92,37.55 55.66,34.29 55.66,31.69 53.67,29.7 v1(53.67,21.88)
IO15: length 6.3
  Top Layer w0.4: U8.23 42.58,25.55 45.8,28.77 v2(46.12,28.77)
M_EN_2: length 72.8
  Top Layer w0.4: H1.8 68.77,65.57 v1(68.77,65.18) 68.77,49.27 70.71,47.32 70.71,31.67 69.64,30.59 68.16,30.59
  Bottom Layer w0.4: P11.4 96.44,74.96 92.89,71.4 81.11,71.4 74.89,65.18 v1(68.77,65.18)
M_EN_O: length 67.4
  Top Layer w0.4: 62.43,23.88 v1(66.17,23.88) ; v1(73.92,24.74) 82.23,24.74 91.21,33.71 95.33,33.71 96.93,35.32 P3.4 97.18,37.5 98.86,39.17 98.86,60.31 97.43,61.73 P8.4
  Bottom Layer w0.4: v1(73.92,24.74) 73.06,23.88 v1(66.17,23.88)
PROBE: length 67.4
  Top Layer w0.4: R26.1 70.21,72.9 v1(69.79,72.47) ; v1(58.41,14.54) 58.13,14.26 U8.7
  Bottom Layer w0.4: v1(58.41,14.54) 58.41,18.92 62.9,23.41 62.9,66.15 68.92,72.17 69.48,72.17 v1(69.79,72.47)
PWM: length 63.7
  Top Layer w0.4: v1(26.38,65.18) 26.38,66.69 R34.1 26.13,66.98 U11.2 ; v1(32.71,68.34) 32.91,68.55 U9.2 ; U8.26 v1(40.31,21.88)
  Bottom Layer w0.4: v1(40.31,21.88) 40.31,39.22 35.92,43.61 35.92,50.75 26.38,60.28 v1(26.38,65.18) 28.17,65.18 31.33,68.34 v1(32.71,68.34)
PWM_5V: length 5
  Top Layer w0.4: R36.2 R35.1 27.08,74.55 U11.4
PWM_LAS: length 24.5
  Top Layer w0.4: U9.4 33.86,75.19 31.28,77.78 ; 31.28,77.78 26.28,77.78 21.13,82.93 P17.2 ; 31.28,77.78 31.84,78.34 P16.2
PWM_OUT: length 3
  Top Layer w0.4: R31.1 24.16,74.14 Q1.3
RX2: length 7.9
  Top Layer w0.4: D9.1 2.99,23.05 P19.2
RXD: length 27.7
  Top Layer w0.4: v1(28.22,20.26) 36.77,11.72 U8.34 ; R37.1 22.15,28.86 H3.2
  Bottom Layer w0.4: H3.2 22.25,26.24 v1(28.22,20.26)
RXD2: length 26.1
  Top Layer w0.4: 13.8,23.1 16.8,23.1 H4.2 31.13,23.46 33.98,20.61 U8.27
SD_CD: length 29.4
  Top Layer w0.4: v1(35.31,14.33) 36.65,12.99 U8.33 ; v1(18.28,10.3) 16.93,11.65 U13.9 16.93,16.62 16.94,16.63
  Bottom Layer w0.4: v1(35.31,14.33) 34.7,14.33 30.67,10.3 v1(18.28,10.3)
SD_CS: length 26.2
  Top Layer w0.4: U13.2 24.63,11.4 28.32,7.7 R40.1 32.88,8.69 v1(34.24,10.05) ; U8.29 36.9,18.07 v1(36.79,17.95)
  Bottom Layer w0.4: v1(36.79,17.95) 36.43,17.6 36.43,12.19 34.29,10.05 v1(34.24,10.05)
SD_MISO: length 26.1
  Top Layer w0.4: v1(19.24,11.53) 19.13,11.64 U13.7 19.13,16.6 R43.1 ; U8.31 v1(34.85,15.53)
  Bottom Layer w0.4: v1(19.24,11.53) 29.85,11.53 33.85,15.53 v1(34.85,15.53)
SD_MOSI: length 21.6
  Top Layer w0.4: U13.3 23.53,10.97 27.56,6.94 v1(29.7,6.94) ; R42.1 35.17,7.91 U8.37
  Bottom Layer w0.4: v1(29.7,6.94) 35.26,6.94 v1(36.23,7.91)
SD_SCLK: length 20.6
  Top Layer w0.4: v1(33.58,16.78) 33.59,16.8 U8.30 ; U13.5 21.33,12.71 v1(21.64,12.39)
  Bottom Layer w0.4: v1(21.64,12.39) 26.69,12.39 31.08,16.78 v1(33.58,16.78)
TEST: length 50.6
  Top Layer w0.4: U8.36 40.2,9.18 v1(40.21,9.18) ; v1(22.61,46.11) 20.26,48.45 R25.1
  Bottom Layer w0.4: v1(22.61,46.11) 29.29,39.42 29.29,28.78 38.57,19.5 38.57,13.06 40.21,11.43 v1(40.21,9.18)
TX2: length 8
  Top Layer w0.4: P19.3 2.64,20.86 D8.2
TXD: length 30.3
  Top Layer w0.4: R38.1 20.06,29.12 H3.1 ; v1(26.84,19.99) 36.39,10.45 U8.35
  Bottom Layer w0.4: v1(26.84,19.99) 19.71,27.13 H3.1
TXD2: length 25.4
  Top Layer w0.4: U8.28 33.42,19.34 31.84,20.92 H4.1 17.1,20.86 13.85,20.86
USB_DM: length 10.7
  Top Layer w0.4: U14.3 17.84,38.41 16.45,39.8 8.48,39.8 8.47,39.81
USB_DP: length 14
  Top Layer w0.4: 5.27,39.81 6.46,41 16.92,41 17.6,40.31 U14.1
VUSB: length 17.4
  Top Layer w0.4: 16.79,34.12 19.85,37.18 19.85,38.9 20.3,39.36 U14.5
  Top Layer w0.6: 8.47,37.31 8.48,37.3 13.61,37.3 16.79,34.12
X_DIR_O: length 31.9
  Top Layer w0.4: P3.2 90.43,30.24 83.42,23.23 U6.1
X_LIMT: length 28.7
  Top Layer w0.4: R6.2 66.2,20.8 58.38,12.99 U8.6
X_LIMT_I: length 10
  Top Layer w0.4: C3.2 84.61,19.22 R5.1 R6.1
  Top Layer w0.6: P2.1 90.34,18.72 89.78,19.28 C3.2
X_STEP_O: length 32.7
  Top Layer w0.4: U6.2 82.49,23.88 91.39,32.78 P3.3
Y1_EN_O: length 44.1
  Top Layer w0.4: 86.78,48.53 72.59,34.33 72.59,28.1 70.96,26.48 U6.6 ; v1(80.6,46.62) 80.08,46.09 R12.1 76.99,46.13 U3.4
  Bottom Layer w0.4: 86.78,48.53 82.51,48.53 v1(80.6,46.62)
Y1_LI: length 11.3
  Top Layer w0.4: U8.8 59.61,15.53 v1(59.94,15.86) ; v1(64.64,16.27) R1.2
  Bottom Layer w0.4: v1(59.94,15.86) 64.23,15.86 v1(64.64,16.27)
Y1_LIMT: length 59.2
  Top Layer w0.4: 68.14,16.27 v1(69.33,16.27) ; R12.2 74.74,44.59 74.17,44.01 U3.2 74.17,41.87 v1(73.2,40.9) ; v1(79.58,13.92) 79.77,13.73 U1.1 80.78,13.73 82.74,11.77 R4.2
  Top Layer w0.6: P4.1 87.21,11.01 C2.2 84.58,11.05 R4.2
  Bottom Layer w0.4: v1(73.2,40.9) 65.5,33.2 65.5,21.17 69.33,17.34 v1(69.33,16.27) 77.23,16.27 v1(79.58,13.92)
Y2_EN_O: length 47.3
  Top Layer w0.4: U5.4 84.51,33.95 82.08,36.37 ; U6.5 71.44,25.83 v1(72.39,26.78) ; 78.76,33.05 78.8,33.05 R15.1 ; 78.76,33.05 82.08,36.37 ; 78.76,33.05 v1(74.83,29.12) ; 82.08,36.37 83.76,38.05 87.99,38.05 v1(92.07,42.13)
  Bottom Layer w0.4: 97.18,48.53 96.93,48.53 92.07,43.67 v1(92.07,42.13) ; v1(72.39,26.78) 74.73,29.12 v1(74.83,29.12)
Y2_LI: length 11.5
  Top Layer w0.4: R2.2 64.99,18.16 v1(64.94,18.11) ; v1(61.52,17.9) 60.42,16.8 U8.9
  Bottom Layer w0.4: v1(61.52,17.9) 61.73,18.11 v1(64.94,18.11)
Y2_LIMT: length 49.1
  Top Layer w0.4: v1(78.1,25.5) 80.55,27.95 R15.2 81.38,29.8 81.92,30.35 83.1,30.35 83.56,29.89 U5.2 ; v1(70.81,19.84) 69.77,19.84 R2.1 77.13,18.16 79.42,15.86 79.42,14.93 79.97,14.38 U1.2 81.99,14.38 R3.2
  Top Layer w0.6: P4.2 90.86,13.31 90.23,13.93 C1.2 82.53,13.93 R3.2
  Bottom Layer w0.4: v1(70.81,19.84) 72.44,19.84 v1(78.1,25.5)
Y_DIR_O: length 39.8
  Top Layer w0.4: 97.18,43.45 86.53,43.45 73.87,30.78 73.87,25.81 72.58,24.53 U6.3
Y_LIMT: length 18.1
  Top Layer w0.4: U8.5 58.45,11.72 61.82,15.08 R8.2
Y_LIMT_I: length 4.5
  Top Layer w0.4: R8.1 74.7,15.08 74.75,15.03 U1.4
Y_STEP_O: length 41.9
  Top Layer w0.4: P7.3 P5.3 85.63,45.99 73.25,33.61 73.25,26.42 72.01,25.18 U6.4
Z_DIR_O: length 44.1
  Top Layer w0.4: 68.16,29.3 70.27,29.3 71.27,30.3 71.27,35.29 82.59,46.62 82.59,48.04 v1(89.24,54.7) ; P8.2 94.16,56.65 v1(92.69,55.18)
  Bottom Layer w0.4: v1(89.24,54.7) 92.2,54.7 v1(92.69,55.18)
Z_LIMT: length 28.8
  Top Layer w0.4: U8.4 58.25,10.45 60.91,13.11 75.24,13.11 80.65,7.7 R13.2
Z_LIMT_I: length 10.1
  Top Layer w0.4: R13.1 81.93,6.11 81.98,6.17 C12.2
  Top Layer w0.6: P6.1 86.31,5.51 85.65,6.17 C12.2
Z_STEP_O: length 46.8
  Top Layer w0.4: P8.3 95.01,59.19 83.15,47.33 83.15,46 71.89,34.74 71.89,28.37 70.65,27.13 U6.7
$9N72390: length 12.6
  Top Layer w0.8: L1.2 44.71,62.3 D2.2
  Top Layer w1: L1.2 52.34,59.38 U2.2
$9N72392: length 3.8
  Top Layer w0.4: R10.1 55.19,54.66 54.52,55.33 U2.4
$9N72730: length 1.8
  Top Layer w0.4: R7.1 21.12,64.15 D3.1
$9N85928: length 3.6
  Top Layer w0.4: C25.1 23.19,41.49 U12.4
$9N85949: length 4
  Top Layer w0.4: U14.6 21.44,40.22 U12.5
$9N85958: length 4.2
  Top Layer w0.4: U14.4 22.01,38.41 22.54,38.95 U12.6
$9N85962: length 10.9
  Top Layer w0.4: Y1.2 30.36,32.85 C26.1 ; 30.04,32.94 30.04,34.47 26.83,37.68 U12.7
$9N85965: length 7
  Top Layer w0.4: C29.1 24.78,32.87 Y1.1 25.35,33.43 25.35,36.41
$9N86544: length 14.4
  Top Layer w0.4: v1(23.57,35.33) 22.15,33.92 R37.2 ; U12.2 26.71,44.03 27.19,43.55 v1(27.19,38.95)
  Bottom Layer w0.4: v1(27.19,38.95) v1(23.57,35.33)
$9N86546: length 20
  Top Layer w0.4: R38.2 20.06,34.53 22.5,36.97 ; U12.3 23.6,42.76 v1(23.57,42.73) 23.57,46.45 24.91,47.79 R39.1
  Bottom Layer w0.4: v1(22.5,36.97) 22.5,41.66 v1(23.57,42.73)
$9N86982: length 6.8
  Top Layer w0.4: U12.13 33.72,41.49 R45.1 35.1,40.72 Q2.2
$9N86987: length 10.1
  Top Layer w0.4: 34.45,42.78 34.43,42.76 U12.14 ; v1(32.95,39.87) 32.95,38.44 Q3.2
  Bottom Layer w0.4: v1(32.95,39.87) v1(32.95,42.78)
$9N89334: length 1.9
  Top Layer w0.4: Q2.1 36.64,42.18 R41.2
$9N89338: length 3
  Top Layer w0.4: Q3.1 36.35,37.26 R45.2
$9N98710: length 30.1
  Top Layer w0.4: K1.3 15.32,49.09 C17.2 ; K1.3 17.31,50.59 R20.2 17.31,48.46 R25.2 ; K1.3 K1.4 13.4,60.91 7.77,60.91 4.04,57.18 P14.1
$9N100484: length 13
  Top Layer w0.4: R21.2 73.19,73.75 71.81,73.75 71.81,75.7 C18.2 71.62,77.82 73.71,79.92 73.71,83.28
$9N100840: length 1.8
  Top Layer w0.4: D7.1 21.1,58.39 R14.1
$9N100955: length 1.8
  Top Layer w0.4: R9.1 21.1,61.14 D5.1
$9N125401: length 9.2
  Top Layer w0.4: v1(19.6,75.43) 19.5,75.33 R33.1 ; v1(24.5,76.25) 25.21,76.25 Q1.1 25.44,76.18 R35.2
  Bottom Layer w0.4: v1(19.6,75.43) 20.42,76.25 v1(24.5,76.25)
$9N133119: length 2.5
  Top Layer w0.6: H1.4 H1.3
$9N166181: length 6.9
  Top Layer w0.4: 62.43,27.78 64.26,27.78 64.79,28.31 64.79,30.04 64.23,30.59 62.43,30.59

## Copper pours and planes (outline as drawn; the poured copper is in the pictures)
GND on Top Layer: -2.02,87.07 101.81,87.07 101.81,-1.21 -2.02,-1.21
GND on Bottom Layer: -1.16,86.92 100.95,86.92 100.95,-1.11 -1.16,-1.11

Small or netless copper shapes (teardrops, artwork), in the pictures only: 432 on Top Layer, 121 on Bottom Layer

## Text on the board
Top Silkscreen Layer: DIR_A | EN | 12V_DIV | CLK_Y2 | DIR_Y2 | 5V | Y1 | Y2 | LIMIT | CLK_X | CLK_Y1 | DIR_X | DIR_Y1 | CLK_A | CLK_Z | DIR_Z | GND | TX | RX | Z_LIMIT | Y_LIMIT | X_LIMIT | TEST | SW | PWM | 24V+ | Probe | A-MOTOR | LY-4X6.0-V2.0 | 20260105
